# EAGLE design ecg (EAGLE 9.6.2)
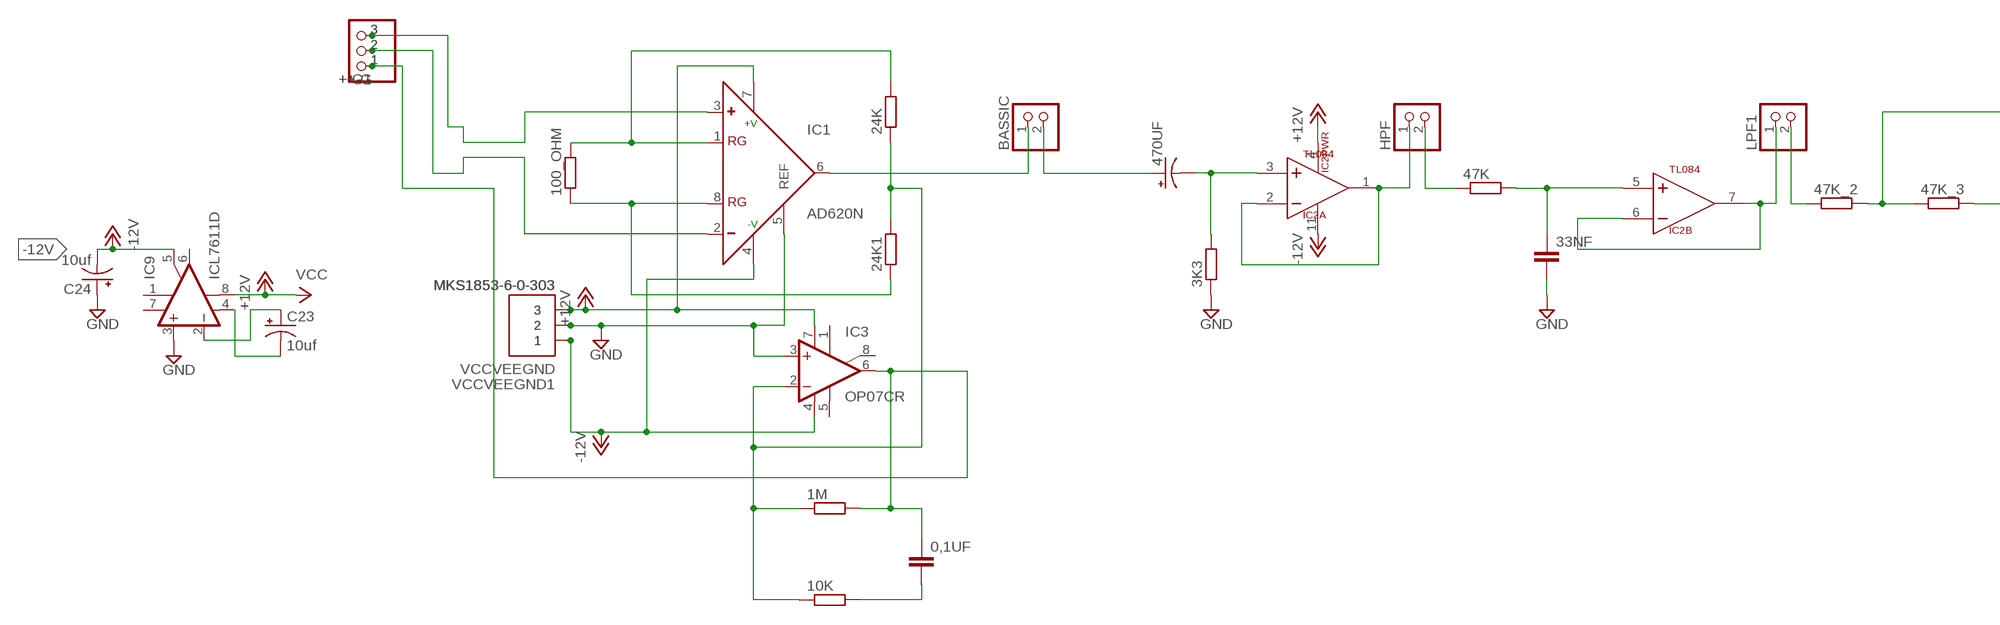
[diagram p0: schematic, sheet 1, part 1 of 2]
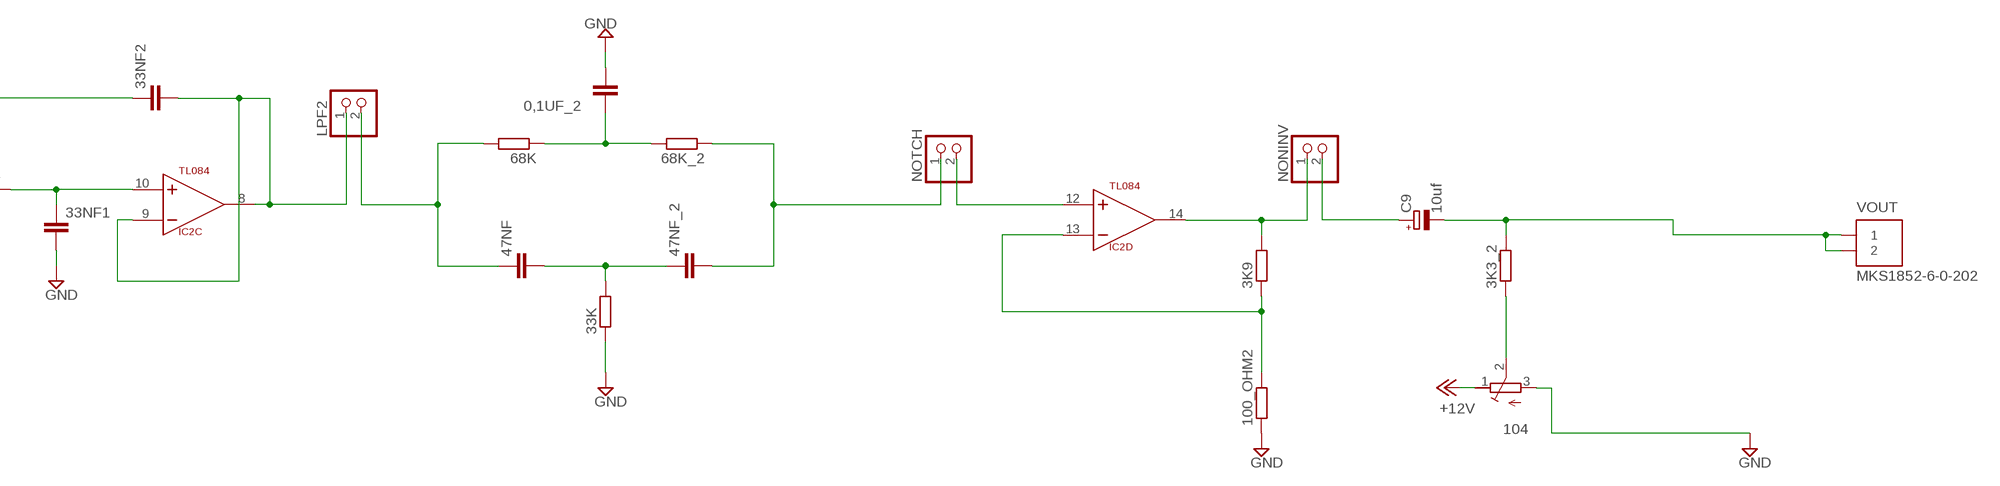
[diagram p1: schematic, sheet 1, part 2 of 2]

## Parts
0,1UF  C-EUC1206  [C1206]
0,1UF_2  C-EUC1206  [C1206]
1M  R-EU_R1206  [R1206]
3K3  R-EU_M1206  [M1206]
3K3_2  R-EU_R1206  [R1206]
3K9  R-EU_R1206  [R1206]
10K  R-EU_M1206  [M1206]
24K  R-EU_M1206  [M1206]
24K1  R-EU_M1206  [M1206]
33K  R-EU_R1206  [R1206]
33NF  C-EUC1206  [C1206]
33NF1  C-EUC1206  [C1206]
33NF2  C-EUC1206  [C1206]
47K  R-EU_M1206  [M1206]
47K_2  R-EU_R1206  [R1206]
47K_3  R-EU_R1206  [R1206]
47NF  C-EUC1206  [C1206]
47NF_2  C-EUC1206  [C1206]
68K  R-EU_R1206  [R1206]
68K_2  R-EU_R1206  [R1206]
100_OHM  R-EU_M1206  [M1206]
100_OHM2  R-EU_R1206  [R1206]
104  R-TRIMMT93YA  [RTRIMT93YA]
470UF  CPOL-US140CLH-1010  [140CLH-1010]
+-G  PINHD-1X3  [1X03]
+-G1  PINHD-1X3  [1X03]
BASSIC  PINHD-1X2  [1X02]
C9  10uf  CPOL-EU140CLH-0810  [140CLH-0810]
C23  10uf  CPOL-US150CLZ-0810  [150CLZ-0810]
C24  10uf  CPOL-US150CLZ-0810  [150CLZ-0810]
HPF  PINHD-1X2  [1X02]
IC1  AD620N  [DIL08]
IC2  TL084  [SO14]
IC3  OP07CR  [SO08]
IC9  ICL7611D  [SO08]
LPF1  PINHD-1X2  [1X02]
LPF2  PINHD-1X2  [1X02]
NONINV  PINHD-1X2  [1X02]
NOTCH  PINHD-1X2  [1X02]
VCCVEEGND  MKS1853-6-0-303  [MKS1853-6-0-303]
VCCVEEGND1  MKS1853-6-0-303  [MKS1853-6-0-303]
VOUT  MKS1852-6-0-202  [MKS1852-6-0-202]

## Nets
+12V: 104.1(E) IC1.7(+V) IC2.4(PWR:VCC+) IC3.7(V+) IC9.8(OPT) VCCVEEGND1.3 VCCVEEGND.3 ; supply symbol labelled VCC
-12V: C24.- IC1.4(-V) IC2.11(PWR:VCC-) IC3.4(V-) IC9.5(ON2) VCCVEEGND1.1 VCCVEEGND.1
GND: 0,1UF_2.2 3K3.1 33K.1 33NF1.2 33NF.2 100_OHM2.1 104.3(A) C24.+ IC1.5(REF) IC3.3(+IN) IC9.3(+IN) VCCVEEGND1.2 VCCVEEGND.2
N$1: 0,1UF.1 1M.2 +-G1.1 +-G.1 IC3.6(OUT)
N$2: 0,1UF.2 10K.2
N$4: 24K1.1 100_OHM.1 IC1.8(RG)
N$5: 24K.2 100_OHM.2 IC1.1(RG)
N$6: 1M.1 10K.1 24K1.2 24K.1 IC3.2(-IN)
N$9: 470UF.+ BASSIC.2
N$10: 3K3.2 470UF.- IC2.3(A:IN+)
N$11: +-G1.2 +-G.2 IC1.2(-)
N$12: +-G1.3 +-G.3 IC1.3(+)
N$13: BASSIC.1 IC1.6(OUT)
N$14: HPF.1 IC2.1(A:OUT) IC2.2(A:IN-)
N$15: 33NF.1 47K.2 IC2.5(B:IN+)
N$16: IC2.6(B:IN-) IC2.7(B:OUT) LPF1.1
N$17: 33NF2.1 47K_2.2 47K_3.1
N$18: 33NF1.1 47K_3.2 IC2.10(C:IN+)
N$19: 33NF2.2 IC2.8(C:OUT) IC2.9(C:IN-) LPF2.1
N$20: 3K9.2 IC2.14(D:OUT) NONINV.1
N$21: 47NF.1 68K.2 LPF2.2
N$22: 0,1UF_2.1 68K.1 68K_2.2
N$23: 33K.2 47NF.2 47NF_2.1
N$24: 47NF_2.2 68K_2.1 NOTCH.1
N$25: 47K.1 HPF.2
N$26: 47K_2.1 LPF1.2
N$27: 3K9.1 100_OHM2.2 IC2.13(D:IN-)
N$28: C9.+ NONINV.2
N$30: 3K3_2.1 104.2(S)
N$31: IC2.12(D:IN+) NOTCH.2
N$35: 3K3_2.2 C9.- VOUT.1 VOUT.2
N$67: C23.+ IC9.2(-IN)
N$68: C23.- IC9.4(V-)
Unconnected: IC3.1(ON1) IC3.5(OPT) IC3.8(ON2) IC9.1(ON1) IC9.6(OUT)

## Power pins joined to a net without a drawn wire
V+: IC9.7(V+)

## Library data of the parts
0,1UF 0,1UF_2 33NF 33NF1 33NF2 47NF 47NF_2 = rcl:C-EU: CAPACITOR, European symbol; SPICEPREFIX: C
1M 3K3 3K3_2 3K9 10K 24K 24K1 33K 47K 47K_2 47K_3 68K 68K_2 100_OHM 100_OHM2 = rcl:R-EU_: RESISTOR, European symbol; SPICEPREFIX: R
104 = rcl:R-TRIMM: Trimm resistor; SPICEMODEL: X; SPICEPREFIXL: POT
470UF C23 C24 = rcl:CPOL-US: POLARIZED CAPACITOR, American symbol; SPICEPREFIX: C
+-G +-G1 = pinhead:PINHD-1X3: PIN HEADER
BASSIC HPF LPF1 LPF2 NONINV NOTCH = pinhead:PINHD-1X2: PIN HEADER
C9 = rcl:CPOL-EU: POLARIZED CAPACITOR, European symbol; SPICEPREFIX: C
IC1 = analog-devices:AD620: Low Cost, Low Power, Instrumentation Amplifier Source: http://www.analog.com/UploadedFiles/Data_Sheets/37793330023930AD620_e.pdf; MF: ALTERA CORPORATION; MPN: AD620AN; OC_FARNELL: 1523782; OC_NEWARK: 05F7108
IC2 = ihpcb-tl084:TL084: OPAMP
IC3 = linear:OP07*: OP AMP
IC9 = linear:ICL7611: OP AMP
VCCVEEGND VCCVEEGND1 = con-stocko:MKS1853-6-0-303: Serie MKS 1850 Lötstifte In-line, Raster 2.5 mm, Stiftwannen, stehend, mit Rastlasche Source: http://www.stocko.de/de/index.php?seite=ka_rfk2_mks1850.html&rubrik=Katalog+-+RFK+2 rfk_1850.pdf; OC_FARNELL: 1141861; OC_NEWARK: unknown
VOUT = con-stocko:MKS1852-6-0-202: Serie MKS 1850 Lötstifte In-line, Raster 2.5 mm, Stiftwannen, stehend, mit Rastlasche Source: http://www.stocko.de/de/index.php?seite=ka_rfk2_mks1850.html&rubrik=Katalog+-+RFK+2 rfk_1850.pdf; OC_FARNELL: unknown; OC_NEWARK: unknown

## Board
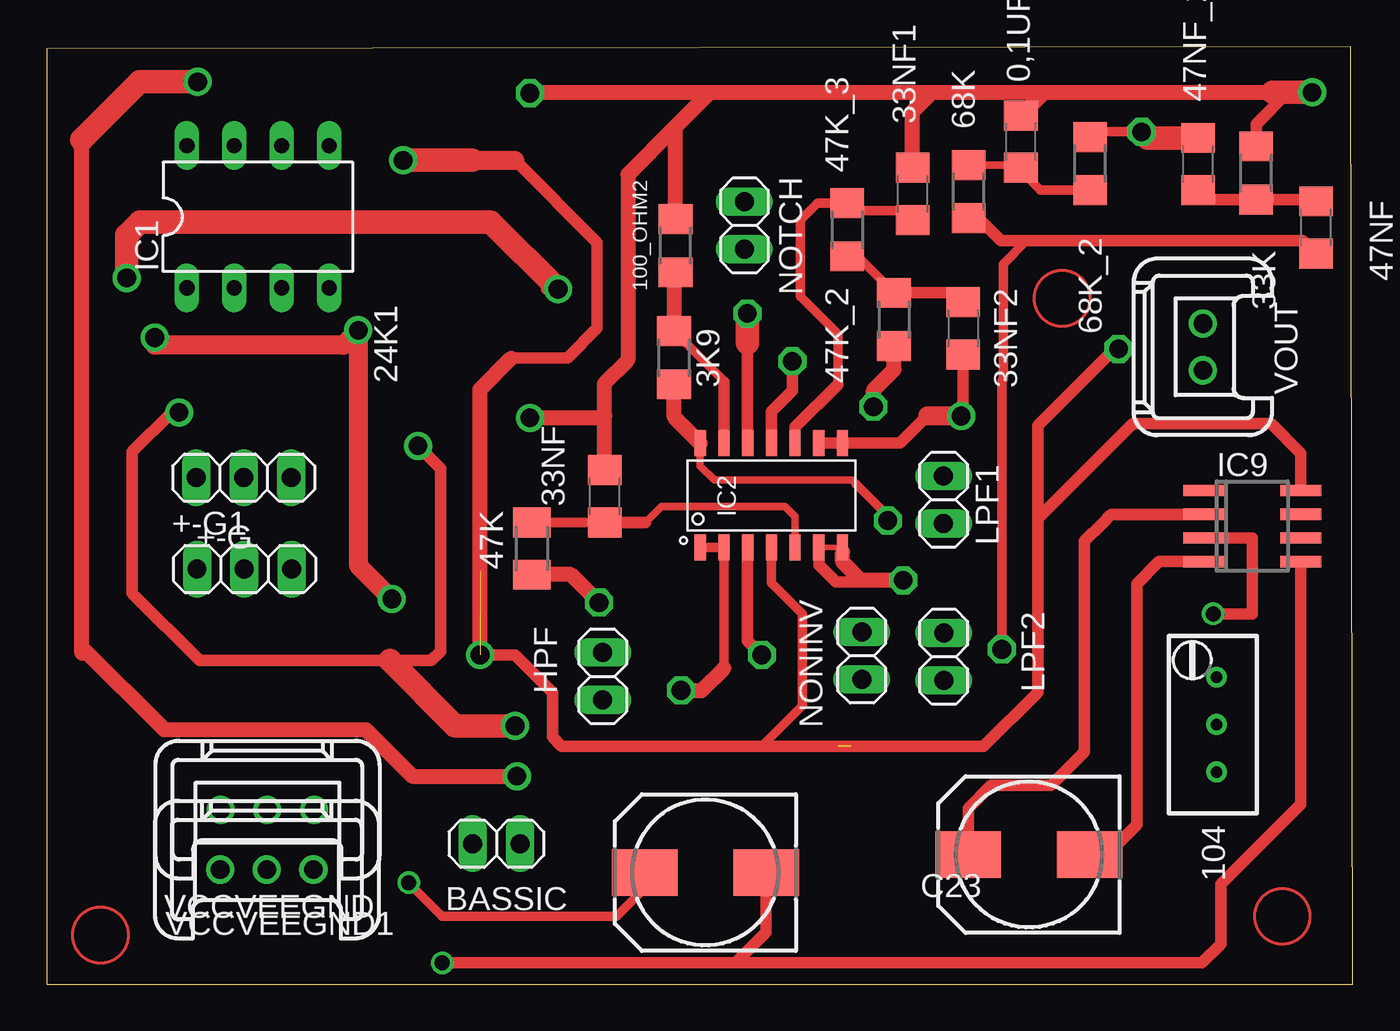
[diagram p2: board, top side]
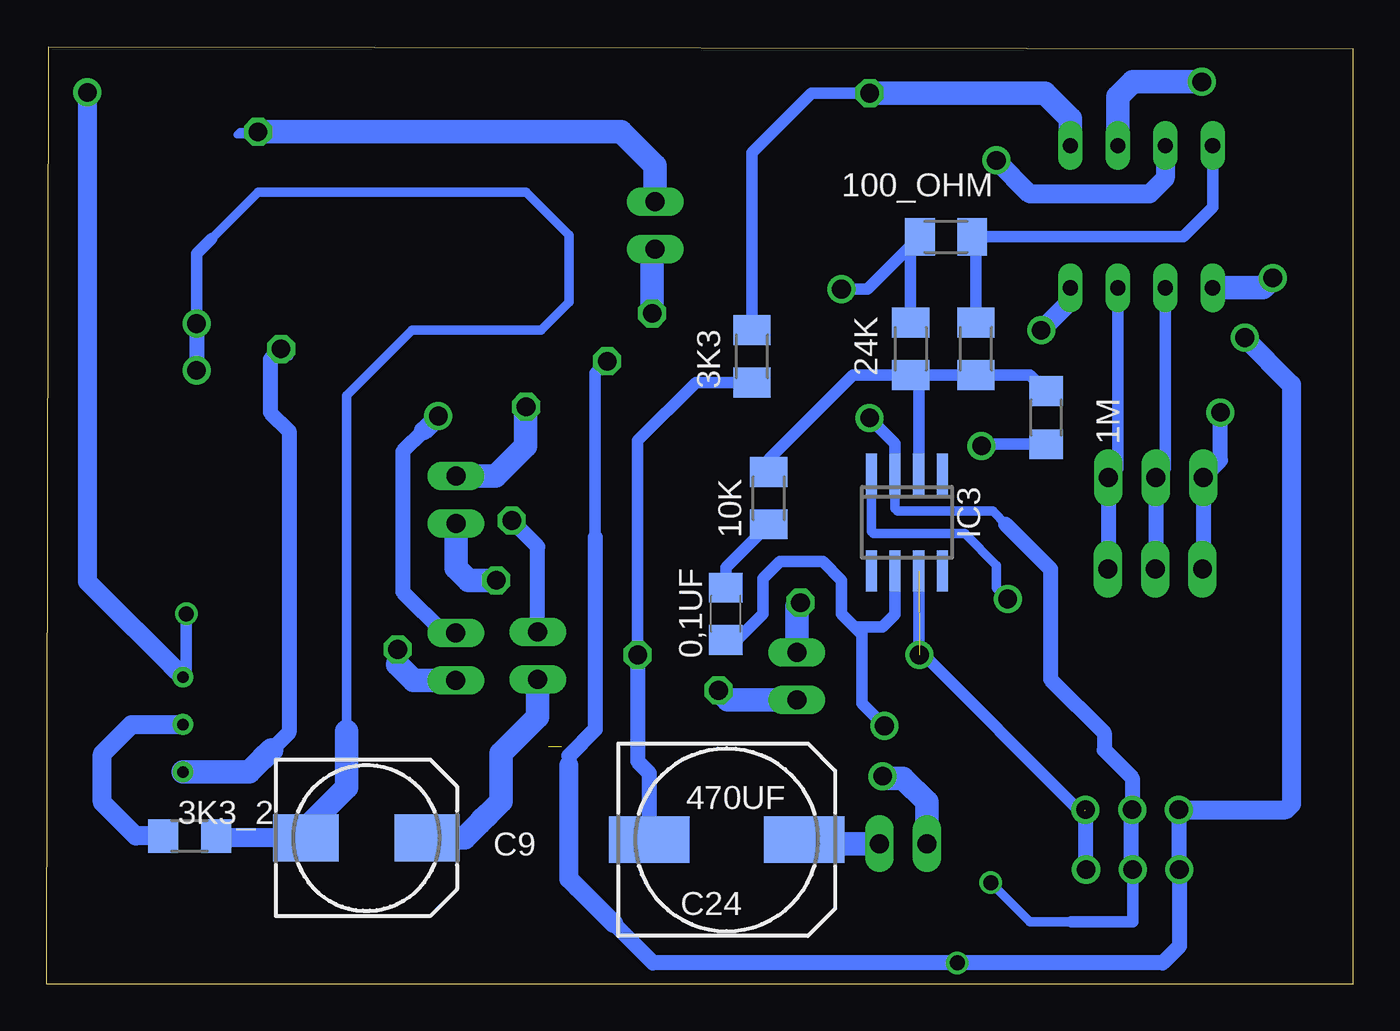
[diagram p3: board, bottom side, seen from below]

Size 69.97 x 50.23 mm. Coordinates in mm from the lower left corner, seen from the top.
Outline: 0,0 69.97,0 69.87,50.23 0,50.13 0,0
Copper layers (1*16): Top 0.035mm / dielectric 1.5mm / Bottom 0.035mm
Design rules "default *": minimum track width 6mil, minimum drill 0.35mm, track to track 1mm, track to pad 1mm, pad to pad 1mm, via to via 1mm, smd to smd 1mm, copper to edge 4mil, drill to drill 6mil, minimum pad ring 10mil, minimum via ring 8mil, stop-mask expansion 4mil, vias tented up to drill 0mil, thermal gap 10mil

### Footprints (pad centres in the part's own frame; a part is rotated, then mirrored left to right if it is on the bottom)
C1206 = smd 1.6 x 1.8: 1 -1.4,0; 2 1.4,0
R1206 = smd 1.6 x 1.803: 1 -1.422,0; 2 1.422,0
M1206 = smd 1.6 x 2: 1 -1.4,0; 2 1.4,0
RTRIMT93YA = drill 0.61: 1 0,-2.54; 2 0,0; 3 0,2.54
140CLH-1010 = smd 4.3 x 2.5: + 4.15,0; - -4.15,0
1X03 = drill 1.016 long: 1 -2.54,0; 2 0,0; 3 2.54,0
1X02 = drill 1.016 long: 1 -1.27,0; 2 1.27,0
140CLH-0810 = smd 3.5 x 2.5: + 3.25,0; - -3.25,0
150CLZ-0810 = smd 3.5 x 2.5: + 3.25,0; - -3.25,0
DIL08 = drill 0.813 long: 1 -3.81,-3.81; 2 -1.27,-3.81; 3 1.27,-3.81; 4 3.81,-3.81; 5 3.81,3.81; 6 1.27,3.81; 7 -1.27,3.81; 8 -3.81,3.81
SO14 = smd 0.6 x 1.4: 1 -3.81,-2.8; 2 -2.54,-2.8; 3 -1.27,-2.8; 4 0,-2.8; 5 1.27,-2.8; 6 2.54,-2.8; 7 3.81,-2.8; 8 3.81,2.8; 9 2.54,2.8; 10 1.27,2.8; 11 0,2.8; 12 -1.27,2.8; 13 -2.54,2.8; 14 -3.81,2.8
SO08 = smd 0.6 x 2.2: 1 -1.905,-2.6; 2 -0.635,-2.6; 3 0.635,-2.6; 4 1.905,-2.6; 5 1.905,2.6; 6 0.635,2.6; 7 -0.635,2.6; 8 -1.905,2.6
MKS1853-6-0-303 = drill 1 pad 1.422: 1 -2.5,0; 2 0,0; 3 2.5,0
MKS1852-6-0-202 = drill 1 pad 1.422: 1 -1.25,0; 2 1.25,0

### Placement (x,y rotation side)
0,1UF  33.59,19.84 90 bottom
0,1UF_2  52.19,45.14 90 top
1M  16.43,30.35 270 bottom
3K3  32.19,33.64 270 bottom
3K3_2  62.31,7.94 0 bottom
3K9  33.61,33.56 270 top
10K  31.29,26.04 270 bottom
24K  23.69,34.04 90 bottom
24K1  20.19,34.04 270 bottom
33K  64.79,43.46 270 top
33NF  29.89,26.14 90 top
33NF1  46.39,42.34 90 top
33NF2  49.09,35.14 270 top
47K  25.99,23.34 90 top
47K_2  45.39,35.62 90 top
47K_3  42.89,40.42 90 top
47NF  67.99,40.54 90 top
47NF_2  61.69,43.94 90 top
68K  49.39,42.46 270 top
68K_2  55.89,43.96 270 top
100_OHM  21.79,40.04 180 bottom
100_OHM2  33.69,39.56 270 top
104  62.67,13.91 0 top
470UF  33.54,7.74 0 bottom
+-G  10.55,27.14 0 top
+-G1  10.59,22.24 0 top
BASSIC  24.09,7.53 0 top
C9  52.84,7.84 0 bottom
C23  52.62,6.94 180 top
C24  35.29,5.98 180 top
HPF  29.78,16.5 90 top
IC1  11.32,41.12 0 top
IC2  38.82,26.19 0 top
IC3  23.89,24.74 180 bottom
IC9  64.58,24.54 270 top
LPF1  48.04,25.96 90 top
LPF2  48.06,17.54 270 top
NONINV  43.67,17.6 270 top
NOTCH  37.38,40.65 270 top
VCCVEEGND  11.82,9.35 0 top
VCCVEEGND1  11.79,6.14 0 top
VOUT  61.94,34.14 90 top

### Tracks (layer width: path | path; a pad name or v marks a point on that pad's centre or on a via)
+12V  (via drill 1, 1 pad 1.5)  (3 unrouted)
  Top 0.406: IC2.4 38.92,23.29
  Top 0.508: IC2.4 38.82,21.51 40.49,19.84 40.49,14.94 38.29,12.74
  Top 0.61: v57.42,34.04 57.19,34.04 53.09,29.94 53.09,24.94 | 53.09,24.94 53.09,15.64 50.19,12.74 42.39,12.74 | 25.09,44.14 29.49,39.74 29.49,35.14 27.89,33.54 24.89,33.54 | v23.22,17.64 25.09,17.64 27.09,15.64 27.09,13.24 27.59,12.74 38.29,12.74 43.09,12.74 | IC9.8 67.19,28.44 65.59,30.04 58.19,30.04 53.09,24.94
  Top 0.813: v23.22,17.64 23.22,31.87 24.89,33.54
  Top 1.016: 22.79,44.14 25.09,44.14
  Top 1.27: v19.09,44.14 22.79,44.14
  Bottom 0.406: 104.1 62.57,11.37
  Bottom 0.508: v57.42,34.04 57.02,33.64 | 57.92,12.56 57.62,12.86
  Bottom 0.61: VCCVEEGND.3 14.7,9.35 23.25,17.91 IC3.7
  Bottom 0.813: v57.42,34.04 57.99,33.47 57.99,30.64 56.99,29.64 56.99,13.49 58.42,12.06 | VCCVEEGND1.3 14.29,9.26 14.35,9.32
  Bottom 1.016: IC1.7 10.05,43.18 10.89,42.34 17.29,42.34 v19.09,44.14
  Bottom 1.27: 104.1 59.11,11.37 58.42,12.06 57.92,12.56
-12V  (via drill 0.8, 1, 1 pad 1.5)
  Top 0.61: IC2.11 38.82,30.67 39.95,31.8 v39.95,33.37 | 36.89,1.14 61.89,1.14 62.89,2.14 62.89,5.34 67.18,9.63 IC9.5 | 36.89,1.14 v21.19,1.14 | C24.- 38.54,2.79 36.89,1.14
  Top 1.016: v5.79,34.64 5.79,34.24 15.89,34.24 v16.69,35.04 16.69,22.44 v18.49,20.64
  Bottom 0.5: IC3.4 25.79,24.24 25.69,24.14 20.79,24.14 19.09,22.44 19.09,21.24 v18.49,20.64
  Bottom 0.61: v39.95,33.37 40.59,32.73 40.59,23.54
  Bottom 0.813: 40.59,23.94 40.59,23.54 40.59,13.64 41.99,12.24 41.99,11.74 41.99,7.84 | VCCVEEGND.1 9.29,9.32 VCCVEEGND1.1 9.29,2.04 10.19,1.14 v21.19,1.14 37.49,1.14 41.54,5.19
  Bottom 1.016: v5.79,34.64 3.29,32.14 3.29,9.64 3.58,9.35 VCCVEEGND.1 | v16.69,35.04 15.13,36.6 IC1.4 | 41.99,11.74 41.99,5.64 41.54,5.19 39.59,3.24
GND  (via drill 0.8, 1, 1 pad 1.5)
  Top 0.508: v19.39,5.44 21.19,3.64 30.54,3.64 32.04,5.14
  Top 0.61: 33NF.2 29.99,27.24 | 68.13,47.78 v67.79,47.78 | IC9.3 64.59,23.91 64.59,19.84 v62.49,19.84 | 32.04,5.14 C24.+ | 33K.1 64.79,46.08 66.49,47.78
  Top 0.813: 25.91,47.76 v25.89,47.74 25.93,47.78 35.53,47.78 | 33NF1.2 46.39,46.74 47.43,47.78 | 0,1UF_2.2 53.43,47.78 | 53.43,47.78 65.69,47.78 | 47.43,47.78 53.43,47.78 | 100_OHM2.1 33.69,45.94 | 35.53,47.78 47.43,47.78 | 33.69,45.94 35.53,47.78 | 33NF.2 29.89,30.44 | 29.89,30.44 29.89,32.2 31.13,33.44 31.13,43.38 33.69,45.94 | 29.89,30.44 29.79,30.34 v25.89,30.34
  Top 1.27: v67.79,47.78 66.49,47.78 65.69,47.78
  Bottom 0.5: IC3.3 24.53,25.48 24.39,25.34 19.29,25.34 18.59,24.64
  Bottom 0.508: 15.09,3.34 17.29,3.34 v19.39,5.44
  Bottom 0.61: v25.89,30.34 24.53,28.98 IC3.3 | v62.49,19.84 62.49,16.45 104.3 | VCCVEEGND1.2 11.79,3.34 15.09,3.34 | 3K3.1 32.19,44.54 28.99,47.74 v25.89,47.74
  Bottom 0.813: 18.59,24.64 16.19,22.24 16.19,16.34 13.32,13.47 13.32,12.55 11.82,11.05 VCCVEEGND.2 11.89,9.28 11.89,6.24 VCCVEEGND1.2 | 25.99,47.84 v25.89,47.74
  Bottom 1.016: 63.29,17.07 104.3 67.79,21.57 v67.79,47.78
  Bottom 1.27: IC1.5 15.13,46.38 16.49,47.74 v25.89,47.74
N$1  (via drill 1)
  Top 0.61: v19.89,28.84 21.09,27.64 21.09,17.84 20.59,17.34 18.39,17.34 8.19,17.34 4.59,20.94 4.59,28.54 6.69,30.64 v7.09,30.64
  Top 1.27: v25.09,13.84 21.89,13.84 18.39,17.34
  Bottom 0.61: IC3.6 24.53,19.8 25.19,19.14 26.69,19.14 | 26.69,19.14 27.04,19.49 27.39,19.84 27.39,21.64 28.39,22.64 30.69,22.64 31.59,21.74 31.59,19.84 32.99,18.44 0,1UF.1 | v19.89,28.84 19.8,28.93 1M.2 | 26.69,19.14 26.29,18.74 26.29,15.04 v25.09,13.84
  Bottom 0.813: v7.09,30.64 7.09,28.06 +-G.1 8.01,22.28 +-G1.1
N$2
  Bottom 0.61: 0,1UF.2 33.59,22.34 10K.2
N$4
  Bottom 0.61: 20.49,35.74 24K1.1 20.19,39.84 100_OHM.1 9.09,40.04 7.51,41.62 IC1.8
N$5  (via drill 1)
  Top 0.61: v27.39,37.24 26.79,37.24
  Top 1.27: v4.29,37.84 4.29,40.14 4.99,40.84 23.79,40.84 v27.39,37.24
  Bottom 0.61: 24K.2 23.69,39.54 100_OHM.2 25.99,37.24 v27.39,37.24
  Bottom 1.27: IC1.1 4.82,37.31 v4.29,37.84
N$6
  Bottom 0.61: 24K.1 24K1.2 17.3,32.64 1M.1 | IC3.2 23.25,32.21 24K.1 | 24K.1 26.79,32.64 31.29,28.14 10K.1
N$9
  Top 0.813: BASSIC.2
  Bottom 0.813: 29.09,7.74 470UF.+
  Bottom 1.27: BASSIC.2 28.88,7.53 29.09,7.74
N$10  (via drill 1 pad 1.5)
  Top 0.406: IC2.3 37.51,23.35 | 38.21,17.74 v38.31,17.64
  Top 0.61: IC2.3 37.55,18.4 v38.31,17.64
  Bottom 0.508: v38.31,17.64 38.12,17.83
  Bottom 0.61: v38.31,17.64 38.31,29.12 35.19,32.24 3K3.2
  Bottom 0.813: v38.31,17.64 38.31,11.94 37.69,11.32 470UF.-
N$11
  Bottom 0.61: IC1.2 10.05,27.64 +-G.2
  Bottom 0.813: +-G.2 10.55,22.24 +-G1.2
N$12
  Bottom 0.61: 13.09,25.79 +-G.3 12.59,27.64 IC1.3
  Bottom 0.813: +-G.3 13.09,22.28 +-G1.3
N$13  (via drill 1)
  Top 0.813: 25.09,11.24 v25.19,11.14 19.59,11.14 17.09,13.64 6.29,13.64 1.89,18.04 | 1.89,17.74 1.89,18.04 | 1.89,18.04 1.89,45.24
  Top 1.27: 1.89,45.24 4.99,48.34 v8.09,48.34
  Bottom 1.27: v25.19,11.14 25.09,11.04 24.09,11.04 22.82,9.77 BASSIC.1 | IC1.6 12.59,47.54 11.79,48.34 v8.09,48.34
N$14  (via drill 1 pad 1.5)
  Top 0.508: 36.28,16.93 IC2.2 IC2.1
  Top 0.813: v33.98,15.74 35.09,15.74 36.28,16.93
  Bottom 1.27: v33.98,15.74 33.47,15.23 HPF.1
N$15
  Top 0.406: IC2.5 40.09,25.06 39.55,25.6 32.95,25.6 32.09,24.74
  Top 0.508: 33NF.1 47K.2
  Top 0.61: 33NF.1 32.09,24.74
N$16  (via drill 1 pad 1.5)
  Top 0.305: 48,24.65 LPF1.1 | IC2.6 IC2.7 42.63,23.14
  Top 0.61: IC2.6 41.36,22.47 42.29,21.54 44.89,21.54 44.99,21.64
  Top 0.813: v45.89,21.64 44.99,21.64 43.63,21.64 42.63,22.64 42.63,23.14
  Bottom 1.27: v45.89,21.64 47.38,21.64 48.04,22.3 LPF1.1
N$17
  Top 0.406: 33NF2.1 49.09,36.92
  Top 0.5: 47K_2.2 43.43,39 47K_3.1
  Top 0.61: 33NF2.1 48.59,37.04 47K_2.2
N$18
  Top 0.305: IC2.10 40.09,29.19
  Top 0.406: 46.54,40.79 33NF1.1
  Top 0.5: 42.39,32.14 42.39,34.84 40.39,36.84 40.39,40.94 41.29,41.84 47K_3.2 43.29,41.44 45.89,41.44 33NF1.1
  Top 0.61: IC2.10 40.09,29.84 42.39,32.14
N$19  (via drill 1)
  Top 0.305: 46.99,30.32 47.01,30.3 | 41.32,28.97 41.55,29.2 | 45.7,28.99 45.77,29.06 47.01,30.3 | 47.01,30.3 47.17,30.46 47.43,30.72
  Top 0.406: IC2.9 41.34,28.97 41.32,28.97 | 45.77,29.06 47.17,30.46
  Top 0.61: IC2.9 IC2.8 45.7,28.99 47.17,30.46 47.19,30.44 | v48.99,30.44 49.09,30.54 33NF2.2
  Top 1.016: v48.99,30.44 47.19,30.44
  Bottom 0.813: LPF2.1 48.69,18.81 50.9,21.02 50.9,28.53 49.79,29.64
  Bottom 1.016: v48.99,30.44 49.79,29.64
N$20  (via drill 1 pad 1.5)
  Top 0.406: IC2.14 35.01,27.77 35.78,27 43.15,27 43.35,26.8 | 45.06,24.58 v45.06,24.84
  Top 0.508: v45.06,24.84 45.06,25.09 43.35,26.8
  Top 0.813: IC2.14 33.61,30.39 3K9.2
  Bottom 0.813: NONINV.1 43.67,23.45 v45.06,24.84
N$21  (via drill 1 pad 1.5)
  Top 0.406: 51.17,39.76 49.89,41.04 68K.2
  Top 0.5: 68K.2 49.69,40.74
  Top 0.508: v51.17,17.94 51.17,32.35 51.24,32.42 51.24,38.59 52.49,39.84
  Top 0.61: 47NF.1 67.3,39.84 52.49,39.84 51.1,39.84 49.9,41.04 68K.2
  Bottom 0.813: 51.17,17.12 v51.17,17.94
  Bottom 1.27: LPF2.2 50.32,16.27 51.17,17.12
N$22
  Top 0.406: 0,1UF_2.1 52.05,43.88 51.89,43.88 68K.1
  Top 0.508: 68K_2.2 53.23,42.54 51.89,43.88
N$23
  Top 0.61: 47NF_2.1 62.19,42.04 33K.2 67.89,42.04 47NF.2
N$24  (via drill 1 pad 1.5)
  Top 0.406: 58.83,45.5 v58.65,45.67
  Top 0.508: 68K_2.1 56.18,45.67 v58.65,45.67
  Top 1.27: v58.65,45.67 58.98,45.34 47NF_2.2
  Bottom 0.406: v58.65,45.67 59.61,45.67 59.77,45.52 58.81,45.52 v58.65,45.67
  Bottom 1.27: v58.65,45.67 39.2,45.67 37.38,43.85 NOTCH.1
N$25  (via drill 1 pad 1.5)
  Top 0.61: v29.59,20.44 28.99,21.04
  Top 0.813: v29.59,20.44 28.09,21.94 47K.1
  Bottom 1.27: v29.59,20.44 29.78,20.25 HPF.2
N$26  (via drill 1 pad 1.5)
  Top 0.305: 44.29,30.77 v44.29,30.94
  Top 0.813: v44.29,30.94 44.29,31.84 45.39,32.94 47K_2.1
  Bottom 0.305: v44.29,30.94 44.31,30.92 44.31,30.84
  Bottom 1.27: LPF1.2 45.92,27.23 44.31,28.84 44.31,30.84
N$27
  Top 0.5: 36.28,32.26 36.28,32.31 3K9.1
  Top 0.61: IC2.13 36.28,32.26
  Top 0.813: 33.69,37.64 100_OHM2.2 33.61,38.06 3K9.1
N$28
  Bottom 1.27: NONINV.2 43.67,14.33 45.64,12.36 45.64,9.79 46.29,9.14 46.69,8.74 46.79,8.64 47.59,7.84 C9.+
N$30
  Bottom 1.016: 3K3_2.1 65.19,7.94 66.99,9.74 66.99,12.34 65.42,13.91 104.2
N$31  (via drill 1 pad 1.5)
  Top 0.406: IC2.12 37.45,29.09
  Top 0.61: IC2.12 37.55,34.34
  Top 1.27: v37.53,35.94 37.53,34.36 37.55,34.34
  Bottom 0.406: 37.38,39.24 NOTCH.2
  Bottom 1.27: v37.53,35.94 37.53,39.09 37.38,39.24
N$35
  Bottom 0.508: 61.14,39.94 58.64,42.44 44.29,42.44 41.99,40.14 41.99,36.54 43.49,35.04 50.39,35.04 53.89,31.54 53.89,12.64
  Bottom 0.61: 56.59,7.84 53.89,10.54 | 61.14,39.94 61.94,39.14 VOUT.1
  Bottom 0.813: VOUT.2 VOUT.1
  Bottom 1.016: C9.- 56.59,7.84 60.79,7.84 3K3_2.2
  Bottom 1.27: VOUT.1 61.99,32.84 | C9.- 56.09,8.34 53.89,10.54 53.89,12.64 53.89,13.54
N$67
  Top 0.61: C23.+ 49.37,9.42 50.59,10.64 53.79,10.64 55.59,12.44 55.59,23.74 56.54,24.69 56.99,25.14 57.03,25.18 IC9.2
N$68
  Top 0.61: IC9.4 59.59,22.64 58.39,21.44 58.39,8.54 56.79,6.94 C23.-
(copper drawn outside any net)
  shapes: Top circle x3

### Text on the board
tValues: -5 | g | +5